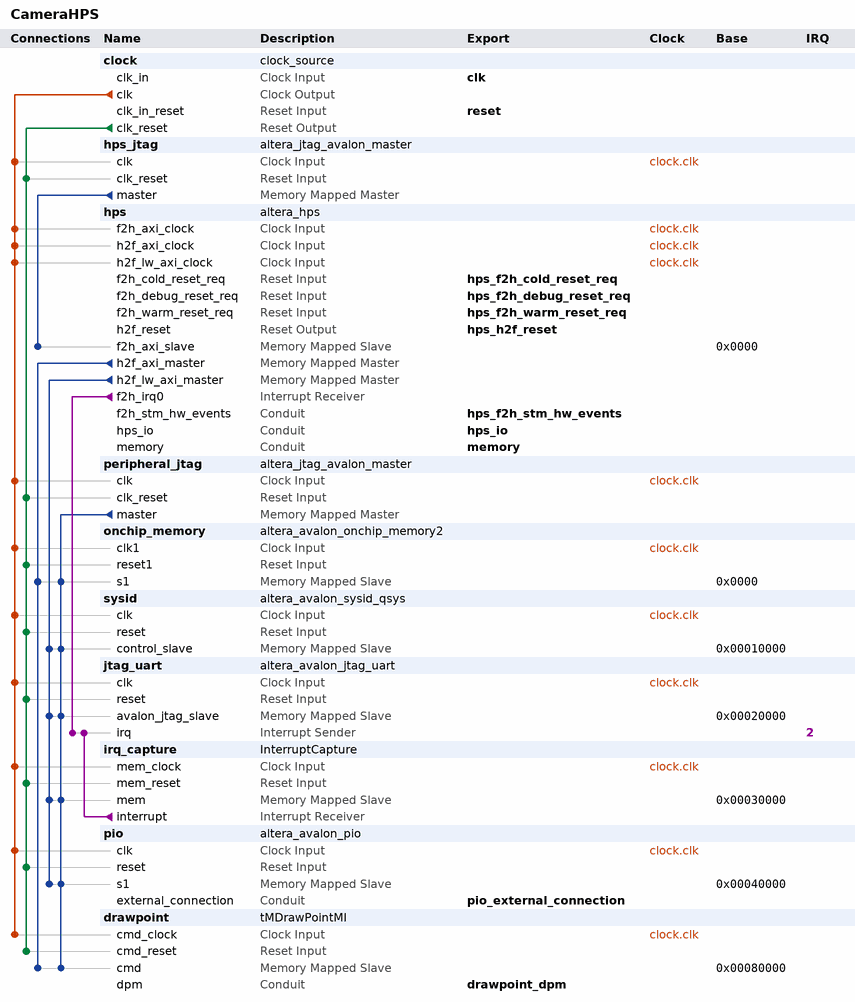
[diagram p0: system contents]
# Platform Designer (Qsys) system CameraHPS, Cyclone V 5CSEMA5F31C6
# Parameters at their usual value, and those the tool derives, are not listed.
package require -exact qsys 16.0
create_system CameraHPS
set_project_property DEVICE_FAMILY {Cyclone V}
set_project_property DEVICE 5CSEMA5F31C6

add_instance clock clock_source 16.0
set_instance_parameter_value clock clockFrequency 50000000
set_instance_parameter_value clock resetSynchronousEdges DEASSERT

add_instance hps_jtag altera_jtag_avalon_master 16.0

add_instance hps altera_hps 16.0
set_instance_parameter_value hps EMAC1_Mode RGMII
set_instance_parameter_value hps EMAC1_PinMuxing {HPS I/O Set 0}
set_instance_parameter_value hps F2SCLK_COLDRST_Enable true
set_instance_parameter_value hps F2SCLK_DBGRST_Enable true
set_instance_parameter_value hps F2SCLK_WARMRST_Enable true
set_instance_parameter_value hps F2SINTERRUPT_Enable true
set_instance_parameter_value hps F2S_Width 2
set_instance_parameter_value hps FPGA_PERIPHERAL_OUTPUT_CLOCK_FREQ_EMAC0_GTX_CLK 125
set_instance_parameter_value hps FPGA_PERIPHERAL_OUTPUT_CLOCK_FREQ_EMAC0_MD_CLK 2.5
set_instance_parameter_value hps FPGA_PERIPHERAL_OUTPUT_CLOCK_FREQ_EMAC1_GTX_CLK 125
set_instance_parameter_value hps FPGA_PERIPHERAL_OUTPUT_CLOCK_FREQ_EMAC1_MD_CLK 2.5
set_instance_parameter_value hps HPS_PROTOCOL DDR3
set_instance_parameter_value hps I2C0_Mode I2C
set_instance_parameter_value hps I2C0_PinMuxing {HPS I/O Set 0}
set_instance_parameter_value hps I2C1_Mode I2C
set_instance_parameter_value hps I2C1_PinMuxing {HPS I/O Set 0}
set_instance_parameter_value hps LWH2F_Enable true
set_instance_parameter_value hps MEM_BANKADDR_WIDTH 3
set_instance_parameter_value hps MEM_CLK_FREQ 400.0
set_instance_parameter_value hps MEM_COL_ADDR_WIDTH 10
set_instance_parameter_value hps MEM_DQ_WIDTH 32
set_instance_parameter_value hps MEM_DRV_STR RZQ/7
set_instance_parameter_value hps MEM_ROW_ADDR_WIDTH 15
set_instance_parameter_value hps MEM_RTT_NOM RZQ/4
set_instance_parameter_value hps MEM_RTT_WR RZQ/4
set_instance_parameter_value hps MEM_TCL 11
set_instance_parameter_value hps MEM_TFAW_NS 30.0
set_instance_parameter_value hps MEM_TRAS_NS 35.0
set_instance_parameter_value hps MEM_TRCD_NS 13.75
set_instance_parameter_value hps MEM_TRFC_NS 260.0
set_instance_parameter_value hps MEM_TRP_NS 13.75
set_instance_parameter_value hps MEM_VENDOR JEDEC
set_instance_parameter_value hps MEM_WTCL 8
set_instance_parameter_value hps QSPI_Mode {1 SS}
set_instance_parameter_value hps QSPI_PinMuxing {HPS I/O Set 0}
set_instance_parameter_value hps REF_CLK_FREQ 25.0
set_instance_parameter_value hps S2FCLK_USER2CLK 5
set_instance_parameter_value hps S2F_Width 2
set_instance_parameter_value hps SDIO_Mode {4-bit Data}
set_instance_parameter_value hps SDIO_PinMuxing {HPS I/O Set 0}
set_instance_parameter_value hps SPIM1_Mode {Single Slave Select}
set_instance_parameter_value hps SPIM1_PinMuxing {HPS I/O Set 0}
set_instance_parameter_value hps STM_Enable true
set_instance_parameter_value hps TIMING_BOARD_AC_SKEW 0.03
set_instance_parameter_value hps TIMING_BOARD_AC_TO_CK_SKEW 0.0
set_instance_parameter_value hps TIMING_BOARD_DQ_TO_DQS_SKEW 0.0
set_instance_parameter_value hps TIMING_BOARD_MAX_CK_DELAY 0.03
set_instance_parameter_value hps TIMING_BOARD_MAX_DQS_DELAY 0.02
set_instance_parameter_value hps TIMING_BOARD_SKEW_BETWEEN_DQS 0.08
set_instance_parameter_value hps TIMING_BOARD_SKEW_CKDQS_DIMM_MAX 0.16
set_instance_parameter_value hps TIMING_BOARD_SKEW_CKDQS_DIMM_MIN 0.09
set_instance_parameter_value hps TIMING_BOARD_SKEW_WITHIN_DQS 0.01
set_instance_parameter_value hps TIMING_TDH 65
set_instance_parameter_value hps TIMING_TDQSCK 255
set_instance_parameter_value hps TIMING_TDQSQ 125
set_instance_parameter_value hps TIMING_TDS 30
set_instance_parameter_value hps TIMING_TIH 140
set_instance_parameter_value hps TIMING_TIS 180
set_instance_parameter_value hps TIMING_TQSH 0.4
set_instance_parameter_value hps UART0_Mode {No Flow Control}
set_instance_parameter_value hps UART0_PinMuxing {HPS I/O Set 0}
set_instance_parameter_value hps USB1_Mode SDR
set_instance_parameter_value hps USB1_PinMuxing {HPS I/O Set 0}
set_instance_parameter_value hps desired_cfg_clk_mhz 100.0
set_instance_parameter_value hps desired_qspi_clk_mhz 400.0
set_instance_parameter_value hps use_default_mpu_clk false

add_instance peripheral_jtag altera_jtag_avalon_master 16.0

add_instance onchip_memory altera_avalon_onchip_memory2 16.0
set_instance_parameter_value onchip_memory dataWidth 32
set_instance_parameter_value onchip_memory dualPort false
set_instance_parameter_value onchip_memory initMemContent true
set_instance_parameter_value onchip_memory initializationFileName onchip_mem.hex
set_instance_parameter_value onchip_memory memorySize 65536

add_instance sysid altera_avalon_sysid_qsys 16.0
set_instance_parameter_value sysid id 1213223728

add_instance jtag_uart altera_avalon_jtag_uart 16.0
set_instance_parameter_value jtag_uart simInteractiveOptions NO_INTERACTIVE_WINDOWS

add_instance irq_capture InterruptCapture 16.0
set_instance_parameter_value irq_capture NUM_INTR 32

add_instance pio altera_avalon_pio 16.0
set_instance_parameter_value pio direction Output
set_instance_parameter_value pio resetValue 65535
set_instance_parameter_value pio width 32

add_instance drawpoint tMDrawPointMI 16.0

# connections
add_connection clock.clk drawpoint.cmd_clock clock
add_connection clock.clk hps.f2h_axi_clock clock
add_connection clock.clk hps.h2f_axi_clock clock
add_connection clock.clk hps.h2f_lw_axi_clock clock
add_connection clock.clk hps_jtag.clk clock
add_connection clock.clk irq_capture.mem_clock clock
add_connection clock.clk jtag_uart.clk clock
add_connection clock.clk onchip_memory.clk1 clock
add_connection clock.clk peripheral_jtag.clk clock
add_connection clock.clk pio.clk clock
add_connection clock.clk sysid.clk clock
add_connection clock.clk_reset drawpoint.cmd_reset reset
add_connection clock.clk_reset hps_jtag.clk_reset reset
add_connection clock.clk_reset irq_capture.mem_reset reset
add_connection clock.clk_reset jtag_uart.reset reset
add_connection clock.clk_reset onchip_memory.reset1 reset
add_connection clock.clk_reset peripheral_jtag.clk_reset reset
add_connection clock.clk_reset pio.reset reset
add_connection clock.clk_reset sysid.reset reset
add_connection hps.h2f_axi_master drawpoint.cmd avalon
set_connection_parameter_value hps.h2f_axi_master/drawpoint.cmd baseAddress 0x00080000
add_connection hps.h2f_axi_master onchip_memory.s1 avalon
set_connection_parameter_value hps.h2f_axi_master/onchip_memory.s1 baseAddress 0x0000
add_connection hps.h2f_lw_axi_master irq_capture.mem avalon
set_connection_parameter_value hps.h2f_lw_axi_master/irq_capture.mem baseAddress 0x00030000
add_connection hps.h2f_lw_axi_master jtag_uart.avalon_jtag_slave avalon
set_connection_parameter_value hps.h2f_lw_axi_master/jtag_uart.avalon_jtag_slave baseAddress 0x00020000
add_connection hps.h2f_lw_axi_master pio.s1 avalon
set_connection_parameter_value hps.h2f_lw_axi_master/pio.s1 baseAddress 0x00040000
add_connection hps.h2f_lw_axi_master sysid.control_slave avalon
set_connection_parameter_value hps.h2f_lw_axi_master/sysid.control_slave baseAddress 0x00010000
add_connection hps_jtag.master hps.f2h_axi_slave avalon
set_connection_parameter_value hps_jtag.master/hps.f2h_axi_slave baseAddress 0x0000
add_connection peripheral_jtag.master drawpoint.cmd avalon
set_connection_parameter_value peripheral_jtag.master/drawpoint.cmd baseAddress 0x00080000
add_connection peripheral_jtag.master irq_capture.mem avalon
set_connection_parameter_value peripheral_jtag.master/irq_capture.mem baseAddress 0x00030000
add_connection peripheral_jtag.master jtag_uart.avalon_jtag_slave avalon
set_connection_parameter_value peripheral_jtag.master/jtag_uart.avalon_jtag_slave baseAddress 0x00020000
add_connection peripheral_jtag.master onchip_memory.s1 avalon
set_connection_parameter_value peripheral_jtag.master/onchip_memory.s1 baseAddress 0x0000
add_connection peripheral_jtag.master pio.s1 avalon
set_connection_parameter_value peripheral_jtag.master/pio.s1 baseAddress 0x00040000
add_connection peripheral_jtag.master sysid.control_slave avalon
set_connection_parameter_value peripheral_jtag.master/sysid.control_slave baseAddress 0x00010000
add_connection hps.f2h_irq0 jtag_uart.irq interrupt
set_connection_parameter_value hps.f2h_irq0/jtag_uart.irq irqNumber 2
add_connection irq_capture.interrupt jtag_uart.irq interrupt
set_connection_parameter_value irq_capture.interrupt/jtag_uart.irq irqNumber 2

# exported interfaces
add_interface clk clock sink
set_interface_property clk EXPORT_OF clock.clk_in
add_interface drawpoint_dpm conduit end
set_interface_property drawpoint_dpm EXPORT_OF drawpoint.dpm
add_interface hps_f2h_cold_reset_req reset sink
set_interface_property hps_f2h_cold_reset_req EXPORT_OF hps.f2h_cold_reset_req
add_interface hps_f2h_debug_reset_req reset sink
set_interface_property hps_f2h_debug_reset_req EXPORT_OF hps.f2h_debug_reset_req
add_interface hps_f2h_stm_hw_events conduit end
set_interface_property hps_f2h_stm_hw_events EXPORT_OF hps.f2h_stm_hw_events
add_interface hps_f2h_warm_reset_req reset sink
set_interface_property hps_f2h_warm_reset_req EXPORT_OF hps.f2h_warm_reset_req
add_interface hps_h2f_reset reset source
set_interface_property hps_h2f_reset EXPORT_OF hps.h2f_reset
add_interface hps_io conduit end
set_interface_property hps_io EXPORT_OF hps.hps_io
add_interface memory conduit end
set_interface_property memory EXPORT_OF hps.memory
add_interface pio_external_connection conduit end
set_interface_property pio_external_connection EXPORT_OF pio.external_connection
add_interface reset reset sink
set_interface_property reset EXPORT_OF clock.clk_in_reset

set_interconnect_requirement {$system} qsys_mm.clockCrossingAdapter HANDSHAKE
set_interconnect_requirement {$system} qsys_mm.enableEccProtection FALSE
set_interconnect_requirement {$system} qsys_mm.insertDefaultSlave FALSE
set_interconnect_requirement {$system} qsys_mm.maxAdditionalLatency 1

save_system CameraHPS.qsys
